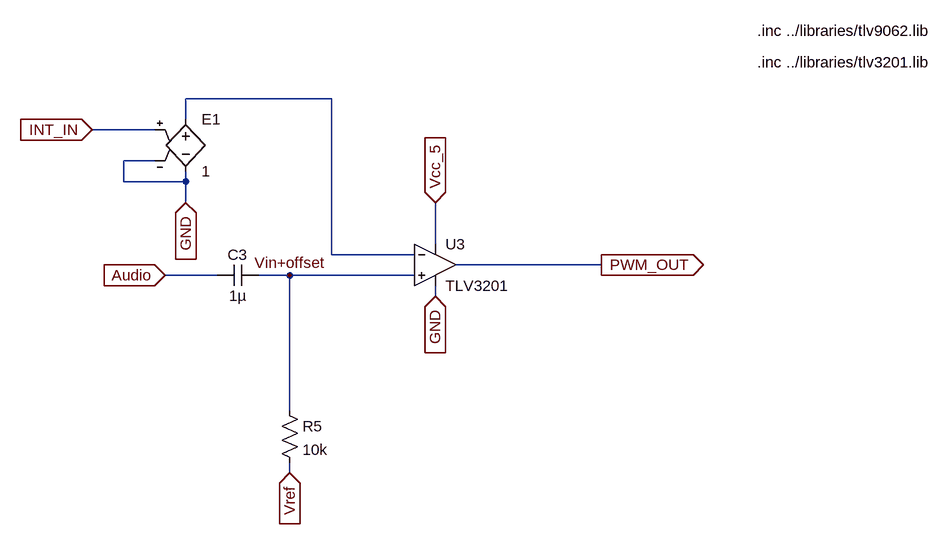
[diagram p0: schematic PWM_modulator_component.asc]
PWM_modulator_component.asc, the LTspice schematic file:
Version 4
SHEET 1 1432 836
WIRE -112 64 -336 64
WIRE -336 96 -336 64
WIRE -384 112 -480 112
WIRE -384 160 -432 160
WIRE -432 192 -432 160
WIRE -336 192 -336 176
WIRE -336 192 -432 192
WIRE -336 224 -336 192
WIRE 48 288 48 224
WIRE -112 304 -112 64
WIRE 16 304 -112 304
WIRE 304 320 80 320
WIRE -288 336 -368 336
WIRE -176 336 -224 336
WIRE 16 336 -176 336
WIRE 48 368 48 352
WIRE -176 544 -176 336
WIRE -176 640 -176 624
FLAG 48 224 Vcc_5
IOPIN 48 224 In
FLAG -480 112 INT_IN
IOPIN -480 112 In
FLAG -176 640 Vref
IOPIN -176 640 In
FLAG -368 336 Audio
IOPIN -368 336 In
FLAG 304 320 PWM_OUT
IOPIN 304 320 Out
FLAG -176 336 Vin+offset
FLAG 48 368 GND
IOPIN 48 368 In
FLAG -336 224 GND
IOPIN -336 224 In
SYMBOL OpAmps\\opamp2 48 256 R0
SYMATTR InstName U3
SYMATTR Value TLV3201
SYMBOL cap -224 320 R90
WINDOW 0 0 32 VBottom 2
WINDOW 3 32 32 VTop 2
SYMATTR InstName C3
SYMATTR Value 1µ
SYMBOL res -192 528 R0
SYMATTR InstName R5
SYMATTR Value 10k
SYMBOL e -336 80 R0
SYMATTR InstName E1
SYMATTR Value 1
TEXT 544 -40 Left 2 !.inc ../libraries/tlv9062.lib
TEXT 544 8 Left 2 !.inc ../libraries/tlv3201.lib

The netlist it stands for:
* PWM_modulator_component.asc
XU3 Vin+offset N001 Vcc_5 GND PWM_OUT TLV3201  ; pins In+ In- V+ V- OUT
C3 Vin+offset Audio 1µ
R5 Vin+offset Vref 10k
E1 N001 GND INT_IN GND 1
.inc ../libraries/tlv9062.lib
.inc ../libraries/tlv3201.lib
.backanno
.end